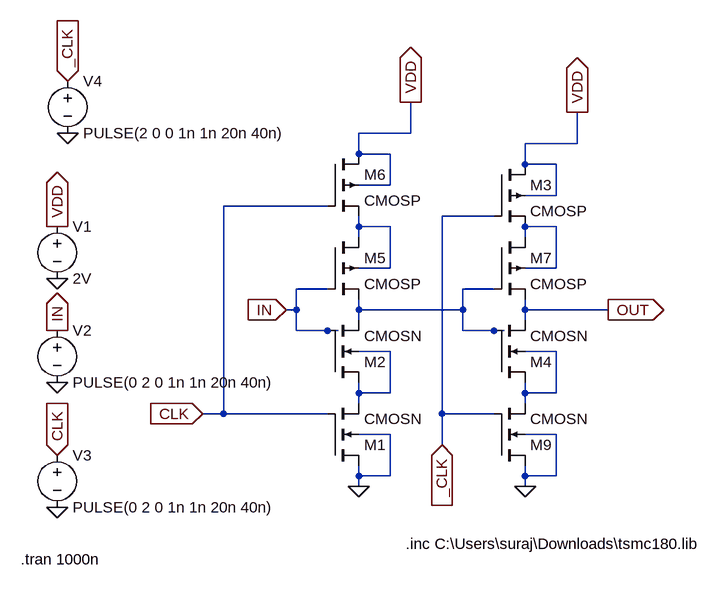
[diagram p0: schematic TriState buffer.asc]
TriState buffer.asc, the LTspice schematic file:
Version 4
SHEET 1 880 680
WIRE 256 -192 256 -240
WIRE 256 -192 176 -192
WIRE 512 -176 512 -224
WIRE 512 -176 432 -176
WIRE 176 -160 176 -192
WIRE 224 -160 176 -160
WIRE 432 -144 432 -176
WIRE 480 -144 432 -144
WIRE 224 -112 224 -160
WIRE 224 -112 176 -112
WIRE 480 -96 480 -144
WIRE 480 -96 432 -96
WIRE 128 -80 -32 -80
WIRE 384 -64 304 -64
WIRE 176 -48 176 -64
WIRE 224 -48 176 -48
WIRE 432 -48 432 -64
WIRE 480 -48 432 -48
WIRE 176 -32 176 -48
WIRE 432 -32 432 -48
WIRE 224 16 224 -48
WIRE 224 16 176 16
WIRE 480 16 480 -48
WIRE 480 16 432 16
WIRE 128 48 80 48
WIRE 384 48 336 48
WIRE 80 80 80 48
WIRE 80 80 64 80
WIRE 176 80 176 64
WIRE 336 80 336 48
WIRE 336 80 176 80
WIRE 432 80 432 64
WIRE 560 80 432 80
WIRE 176 96 176 80
WIRE 432 96 432 80
WIRE 80 112 80 80
WIRE 128 112 80 112
WIRE 144 112 128 112
WIRE 336 112 336 80
WIRE 384 112 336 112
WIRE 400 112 384 112
WIRE 224 144 176 144
WIRE 480 144 432 144
WIRE 176 208 176 192
WIRE 224 208 224 144
WIRE 224 208 176 208
WIRE 432 208 432 192
WIRE 480 208 480 144
WIRE 480 208 432 208
WIRE 176 224 176 208
WIRE 432 224 432 208
WIRE -32 240 -32 -80
WIRE -32 240 -64 240
WIRE 128 240 -32 240
WIRE 304 240 304 -64
WIRE 384 240 304 240
WIRE 224 272 176 272
WIRE 480 272 432 272
WIRE 304 288 304 240
WIRE 176 336 176 320
WIRE 224 336 224 272
WIRE 224 336 176 336
WIRE 432 336 432 320
WIRE 480 336 480 272
WIRE 480 336 432 336
WIRE 176 352 176 336
WIRE 432 352 432 336
FLAG 176 352 0
FLAG -288 -48 VDD
IOPIN -288 -48 Out
FLAG 256 -240 VDD
IOPIN 256 -240 Out
FLAG -288 32 0
FLAG -288 192 0
FLAG -288 112 IN
IOPIN -288 112 Out
FLAG 64 80 IN
IOPIN 64 80 In
FLAG -64 240 CLK
IOPIN -64 240 In
FLAG -288 304 CLK
IOPIN -288 304 In
FLAG 560 80 OUT
IOPIN 560 80 Out
FLAG -288 384 0
FLAG 512 -224 VDD
IOPIN 512 -224 Out
FLAG 432 352 0
FLAG 304 288 _CLK
IOPIN 304 288 In
FLAG -272 -272 _CLK
IOPIN -272 -272 In
FLAG -272 -192 0
SYMBOL nmos4 128 320 M180
SYMATTR InstName M1
SYMATTR Value CMOSN
SYMATTR Value2 l=0.18u w=20u
SYMBOL nmos4 128 192 M180
SYMATTR InstName M2
SYMATTR Value CMOSN
SYMATTR Value2 l=0.18u w=10u
SYMBOL pmos4 128 -32 R0
SYMATTR InstName M5
SYMATTR Value CMOSP
SYMATTR Value2 l=0.18u w=20u
SYMBOL pmos4 128 -160 R0
SYMATTR InstName M6
SYMATTR Value CMOSP
SYMATTR Value2 l=0.18u w=20u
SYMBOL voltage -288 -64 R0
WINDOW 123 0 0 Left 0
WINDOW 39 0 0 Left 0
SYMATTR InstName V1
SYMATTR Value 2V
SYMBOL voltage -288 96 R0
WINDOW 123 0 0 Left 0
WINDOW 39 0 0 Left 0
SYMATTR InstName V2
SYMATTR Value PULSE(0 2 0 1n 1n 20n 40n)
SYMBOL voltage -288 288 R0
WINDOW 123 0 0 Left 0
WINDOW 39 0 0 Left 0
SYMATTR InstName V3
SYMATTR Value PULSE(0 2 0 1n 1n 20n 40n)
SYMBOL nmos4 384 192 M180
SYMATTR InstName M4
SYMATTR Value CMOSN
SYMATTR Value2 l=0.18u w=10u
SYMBOL pmos4 384 -32 R0
SYMATTR InstName M7
SYMATTR Value CMOSP
SYMATTR Value2 l=0.18u w=20u
SYMBOL pmos4 384 -144 R0
SYMATTR InstName M3
SYMATTR Value CMOSP
SYMATTR Value2 l=0.18u w=20u
SYMBOL nmos4 384 320 M180
SYMATTR InstName M9
SYMATTR Value CMOSN
SYMATTR Value2 l=0.18u w=20u
SYMBOL voltage -272 -288 R0
WINDOW 123 0 0 Left 0
WINDOW 39 0 0 Left 0
SYMATTR InstName V4
SYMATTR Value PULSE(2 0 0 1n 1n 20n 40n)
TEXT 248 440 Left 2 !.inc C:\\Users\\suraj\\Downloads\\tsmc180.lib
TEXT -344 464 Left 2 !.tran 1000n

The netlist it stands for:
* TriState buffer.asc
M1 0 CLK N004 0 CMOSN l=0.18u w=20u
M2 N004 IN N003 N004 CMOSN l=0.18u w=10u
M5 N001 IN N003 N001 CMOSP l=0.18u w=20u
M6 VDD CLK N001 VDD CMOSP l=0.18u w=20u
V1 VDD 0 2V
V2 IN 0 PULSE(0 2 0 1n 1n 20n 40n)
V3 CLK 0 PULSE(0 2 0 1n 1n 20n 40n)
M4 N005 N003 OUT N005 CMOSN l=0.18u w=10u
M7 N002 N003 OUT N002 CMOSP l=0.18u w=20u
M3 VDD _CLK N002 VDD CMOSP l=0.18u w=20u
M9 0 _CLK N005 0 CMOSN l=0.18u w=20u
V4 _CLK 0 PULSE(2 0 0 1n 1n 20n 40n)
.model NMOS NMOS
.model PMOS PMOS
.lib standard.mos
.inc C:\Users\suraj\Downloads\tsmc180.lib
.tran 1000n
.backanno
.end